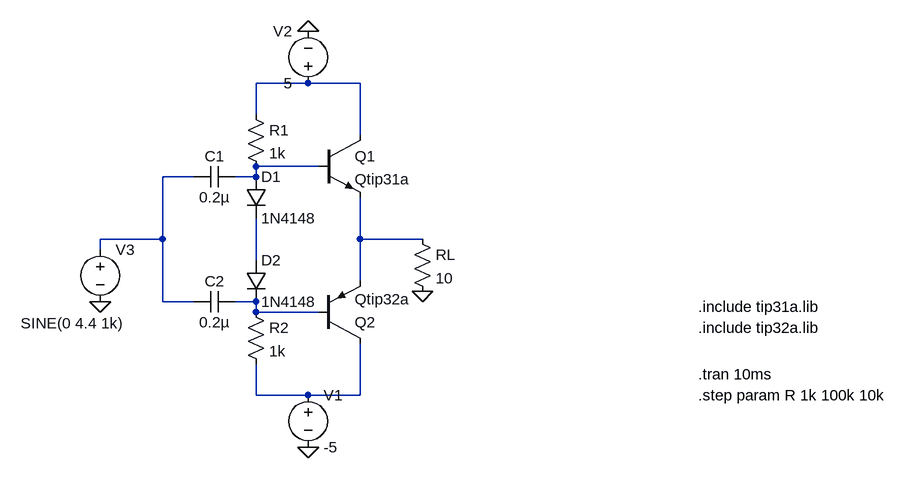
[diagram p0: schematic power_amp.asc]
power_amp.asc, the LTspice schematic file:
Version 4
SHEET 1 1124 680
WIRE 208 -128 128 -128
WIRE 288 -128 208 -128
WIRE 128 -80 128 -128
WIRE 288 -48 288 -128
WIRE 224 0 128 0
WIRE 32 16 -16 16
WIRE 128 16 128 0
WIRE 128 16 96 16
WIRE -16 112 -16 16
WIRE -16 112 -112 112
WIRE 288 112 288 48
WIRE 384 112 288 112
WIRE -112 128 -112 112
WIRE 128 144 128 80
WIRE 288 176 288 112
WIRE -16 208 -16 112
WIRE 32 208 -16 208
WIRE 128 208 96 208
WIRE 128 224 128 208
WIRE 224 224 128 224
WIRE 128 352 128 304
WIRE 208 352 128 352
WIRE 288 352 288 272
WIRE 288 352 208 352
FLAG 208 -208 0
FLAG 208 432 0
FLAG -112 208 0
FLAG 384 192 0
SYMBOL npn 224 -48 R0
SYMATTR InstName Q1
SYMATTR Value Qtip31a
SYMBOL diode 112 16 R0
SYMATTR InstName D1
SYMATTR Value 1N4148
SYMBOL diode 112 144 R0
SYMATTR InstName D2
SYMATTR Value 1N4148
SYMBOL res 112 -96 R0
SYMATTR InstName R1
SYMATTR Value 1k
SYMBOL res 112 208 R0
SYMATTR InstName R2
SYMATTR Value 1k
SYMBOL voltage 208 336 R0
WINDOW 123 0 0 Left 0
WINDOW 39 0 0 Left 0
SYMATTR InstName V1
SYMATTR Value -5
SYMBOL voltage 208 -112 R180
WINDOW 0 24 96 Left 2
WINDOW 3 24 16 Left 2
WINDOW 123 0 0 Left 0
WINDOW 39 0 0 Left 0
SYMATTR InstName V2
SYMATTR Value 5
SYMBOL voltage -112 112 R0
WINDOW 123 0 0 Left 0
WINDOW 39 0 0 Left 0
WINDOW 3 -122 129 Left 2
SYMATTR InstName V3
SYMATTR Value SINE(0 4.4 1k)
SYMBOL res 368 96 R0
SYMATTR InstName RL
SYMATTR Value 10
SYMBOL cap 96 192 R90
WINDOW 0 0 32 VBottom 2
WINDOW 3 32 32 VTop 2
SYMATTR InstName C2
SYMATTR Value 0.2µ
SYMBOL cap 96 0 R90
WINDOW 0 0 32 VBottom 2
WINDOW 3 32 32 VTop 2
SYMATTR InstName C1
SYMATTR Value 0.2µ
SYMBOL pnp 224 272 M180
SYMATTR InstName Q2
SYMATTR Value Qtip32a
TEXT 808 216 Left 2 !.include tip31a.lib
TEXT 808 248 Left 2 !.include tip32a.lib
TEXT 808 320 Left 2 !.tran 10ms
TEXT 808 352 Left 2 !.step param R 1k 100k 10k

The netlist it stands for:
* power_amp.asc
Q1 N001 N002 N004 0 Qtip31a
D1 N002 N005 1N4148
D2 N005 N006 1N4148
R1 N001 N002 1k
R2 N006 N007 1k
V1 N007 0 -5
V2 N001 0 5
V3 N003 0 SINE(0 4.4 1k)
RL N004 0 10
C2 N006 N003 0.2µ
C1 N002 N003 0.2µ
Q2 N007 N006 N004 0 Qtip32a
.model D D
.lib standard.dio
.model NPN NPN
.model PNP PNP
.lib standard.bjt
.include tip31a.lib
.include tip32a.lib
.tran 10ms
.step param R 1k 100k 10k
.backanno
.end